# Altium schematic sheet Sheet1.SchDoc: PLCC 68-PIN Adapter
size A3; Organization: Altium Limited; Address1: L3, 12a Rodborough Rd; Address2: Frenchs Forest; Address3: NSW; Address4: Australia 2086; Revision: 1.0; SheetNumber: 1; SheetTotal: 1
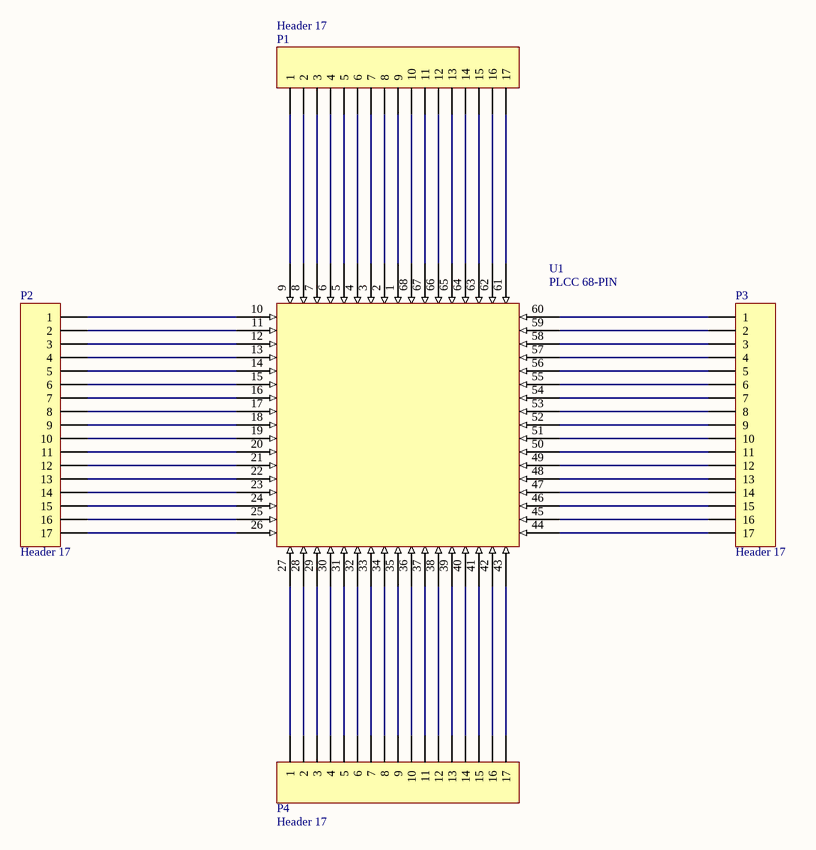
[diagram p0: Sheet1.SchDoc]

## Parts
P1  Header 17  [HDR1X17]
P2  Header 17  [HDR1X17]
P3  Header 17  [HDR1X17]
P4  Header 17  [HDR1X17]
U1  PLCC 68-PIN  [PLCC68]

## Nets
NetP1_1: P1.1 U1.9
NetP1_2: P1.2 U1.8
NetP1_3: P1.3 U1.7
NetP1_4: P1.4 U1.6
NetP1_5: P1.5 U1.5
NetP1_6: P1.6 U1.4
NetP1_7: P1.7 U1.3
NetP1_8: P1.8 U1.2
NetP1_9: P1.9 U1.1
NetP1_10: P1.10 U1.68
NetP1_11: P1.11 U1.67
NetP1_12: P1.12 U1.66
NetP1_13: P1.13 U1.65
NetP1_14: P1.14 U1.64
NetP1_15: P1.15 U1.63
NetP1_16: P1.16 U1.62
NetP1_17: P1.17 U1.61
NetP2_1: P2.1 U1.10
NetP2_2: P2.2 U1.11
NetP2_3: P2.3 U1.12
NetP2_4: P2.4 U1.13
NetP2_5: P2.5 U1.14
NetP2_6: P2.6 U1.15
NetP2_7: P2.7 U1.16
NetP2_8: P2.8 U1.17
NetP2_9: P2.9 U1.18
NetP2_10: P2.10 U1.19
NetP2_11: P2.11 U1.20
NetP2_12: P2.12 U1.21
NetP2_13: P2.13 U1.22
NetP2_14: P2.14 U1.23
NetP2_15: P2.15 U1.24
NetP2_16: P2.16 U1.25
NetP2_17: P2.17 U1.26
NetP3_1: P3.1 U1.60
NetP3_2: P3.2 U1.59
NetP3_3: P3.3 U1.58
NetP3_4: P3.4 U1.57
NetP3_5: P3.5 U1.56
NetP3_6: P3.6 U1.55
NetP3_7: P3.7 U1.54
NetP3_8: P3.8 U1.53
NetP3_9: P3.9 U1.52
NetP3_10: P3.10 U1.51
NetP3_11: P3.11 U1.50
NetP3_12: P3.12 U1.49
NetP3_13: P3.13 U1.48
NetP3_14: P3.14 U1.47
NetP3_15: P3.15 U1.46
NetP3_16: P3.16 U1.45
NetP3_17: P3.17 U1.44
NetP4_1: P4.1 U1.27
NetP4_2: P4.2 U1.28
NetP4_3: P4.3 U1.29
NetP4_4: P4.4 U1.30
NetP4_5: P4.5 U1.31
NetP4_6: P4.6 U1.32
NetP4_7: P4.7 U1.33
NetP4_8: P4.8 U1.34
NetP4_9: P4.9 U1.35
NetP4_10: P4.10 U1.36
NetP4_11: P4.11 U1.37
NetP4_12: P4.12 U1.38
NetP4_13: P4.13 U1.39
NetP4_14: P4.14 U1.40
NetP4_15: P4.15 U1.41
NetP4_16: P4.16 U1.42
NetP4_17: P4.17 U1.43

## Notes on the sheet
- Title
- Size:
- Date:
- A3
- Number:
- Time:
- Revision:
- Sheet
- of
- File:

## Library data of the parts
P1-P4 = Header 17: Header, 17-Pin; LatestRevisionDate: 17-Jul-2002; LatestRevisionNote: Re-released for DXP Platform.; Publisher: Altium Limited
U1 = PLCC 68-PIN: Custom IC; Value: PLCC 68-PIN; Supplier 1: Farnell; Supplier Part Number 1: 1183031